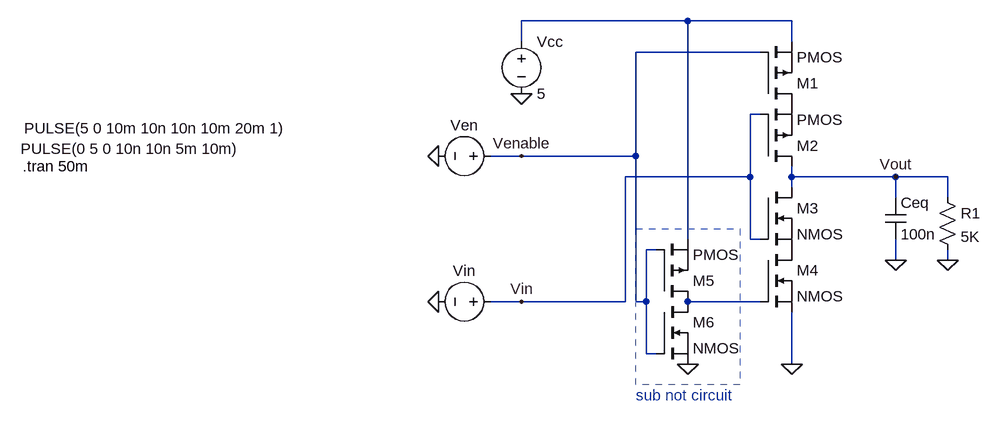
[diagram p0: schematic cmos_inv_tristate.asc]
cmos_inv_tristate.asc, the LTspice schematic file:
Version 4.1
SHEET 1 880 680
WIRE 64 32 -192 32
WIRE 224 32 64 32
WIRE -192 64 -192 32
WIRE 224 64 224 32
WIRE 176 80 -16 80
WIRE 176 176 160 176
WIRE -192 240 -240 240
WIRE -16 240 -16 80
WIRE -16 240 -192 240
WIRE 160 272 160 176
WIRE 160 272 -32 272
WIRE 224 272 224 256
WIRE 384 272 224 272
WIRE 464 272 384 272
WIRE 224 288 224 272
WIRE 384 304 384 272
WIRE 464 304 464 272
WIRE 64 368 64 32
WIRE 160 368 160 272
WIRE 176 368 160 368
WIRE 16 384 0 384
WIRE 384 400 384 368
WIRE 464 400 464 384
WIRE -192 464 -240 464
WIRE -32 464 -32 272
WIRE -32 464 -192 464
WIRE -16 464 -16 240
WIRE 0 464 0 384
WIRE 0 464 -16 464
WIRE 176 464 64 464
WIRE 0 544 0 464
WIRE 16 544 0 544
WIRE 224 560 224 480
FLAG 64 560 0
FLAG 224 560 0
FLAG -192 144 0
FLAG -192 240 Venable
FLAG -192 464 Vin
FLAG -320 464 0
FLAG -320 240 0
FLAG 384 400 0
FLAG 384 272 Vout
FLAG 464 400 0
SYMBOL pmos 176 160 M180
SYMATTR InstName M1
SYMBOL pmos 176 256 M180
SYMATTR InstName M2
SYMBOL nmos 176 288 R0
SYMATTR InstName M3
SYMBOL nmos 176 384 R0
SYMATTR InstName M4
SYMBOL pmos 16 464 M180
SYMATTR InstName M5
SYMBOL nmos 16 464 R0
SYMATTR InstName M6
SYMBOL voltage -192 48 R0
SYMATTR InstName Vcc
SYMATTR Value 5
SYMBOL voltage -224 240 R90
WINDOW 0 -32 56 VBottom 2
WINDOW 3 -58 531 VTop 2
WINDOW 123 0 0 Left 0
WINDOW 39 -173 310 VTop 2
SYMATTR InstName Ven
SYMATTR Value PULSE(5 0 10m 10n 10n 10m 20m 1)
SYMBOL voltage -224 464 R90
WINDOW 0 -32 56 VBottom 2
WINDOW 3 -251 570 VTop 2
WINDOW 123 0 0 Left 0
WINDOW 39 0 0 Left 0
SYMATTR InstName Vin
SYMATTR Value PULSE(0 5 0 10n 10n 5m 10m)
SYMBOL cap 368 304 R0
SYMATTR InstName Ceq
SYMATTR Value 100n
SYMBOL res 448 288 R0
SYMATTR InstName R1
SYMATTR Value 5K
TEXT -16 608 Left 2 ;sub not circuit
TEXT -960 256 Left 2 !.tran 50m
RECTANGLE Normal 144 592 -16 352 1

The netlist it stands for:
* cmos_inv_tristate.asc
M1 P001 Venable N001 N001 PMOS
M2 Vout Vin P001 P001 PMOS
M3 Vout Vin P002 P002 NMOS
M4 P002 N002 0 0 NMOS
M5 N002 Venable N001 N001 PMOS
M6 N002 Venable 0 0 NMOS
Vcc N001 0 5
Ven Venable 0 PULSE(5 0 10m 10n 10n 10m 20m 1)
Vin Vin 0 PULSE(0 5 0 10n 10n 5m 10m)
Ceq Vout 0 100n
R1 Vout 0 5K
.model NMOS NMOS
.model PMOS PMOS
.lib standard.mos
* sub not circuit
.tran 50m
.backanno
.end

* Results of the author's LTspice run, read from the files saved beside the schematic
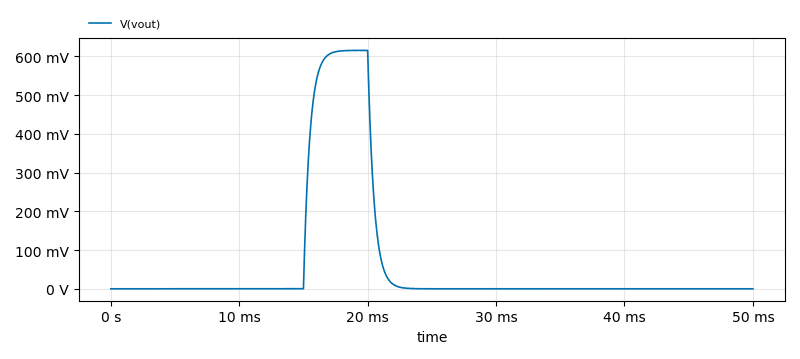
[diagram p1: Transient Analysis of cmos_inv_tristate.asc, plotted from the saved traces]
* Transient Analysis, 1 run:
*   V(vout): min 0 V, max 615.5 mV, average 61.69 mV, rms 185 mV, last 0 V